# EasyEDA schematic SCH_OPN+OPLL Mixer v0.1_2023-10-10.json

## Sheets
1 Connector: TITLE: Sheet_1; REV: 1.0; Date: 2023-10-09; Sheet: 1/1; Drawn By: Denjhang; Company: Your Company
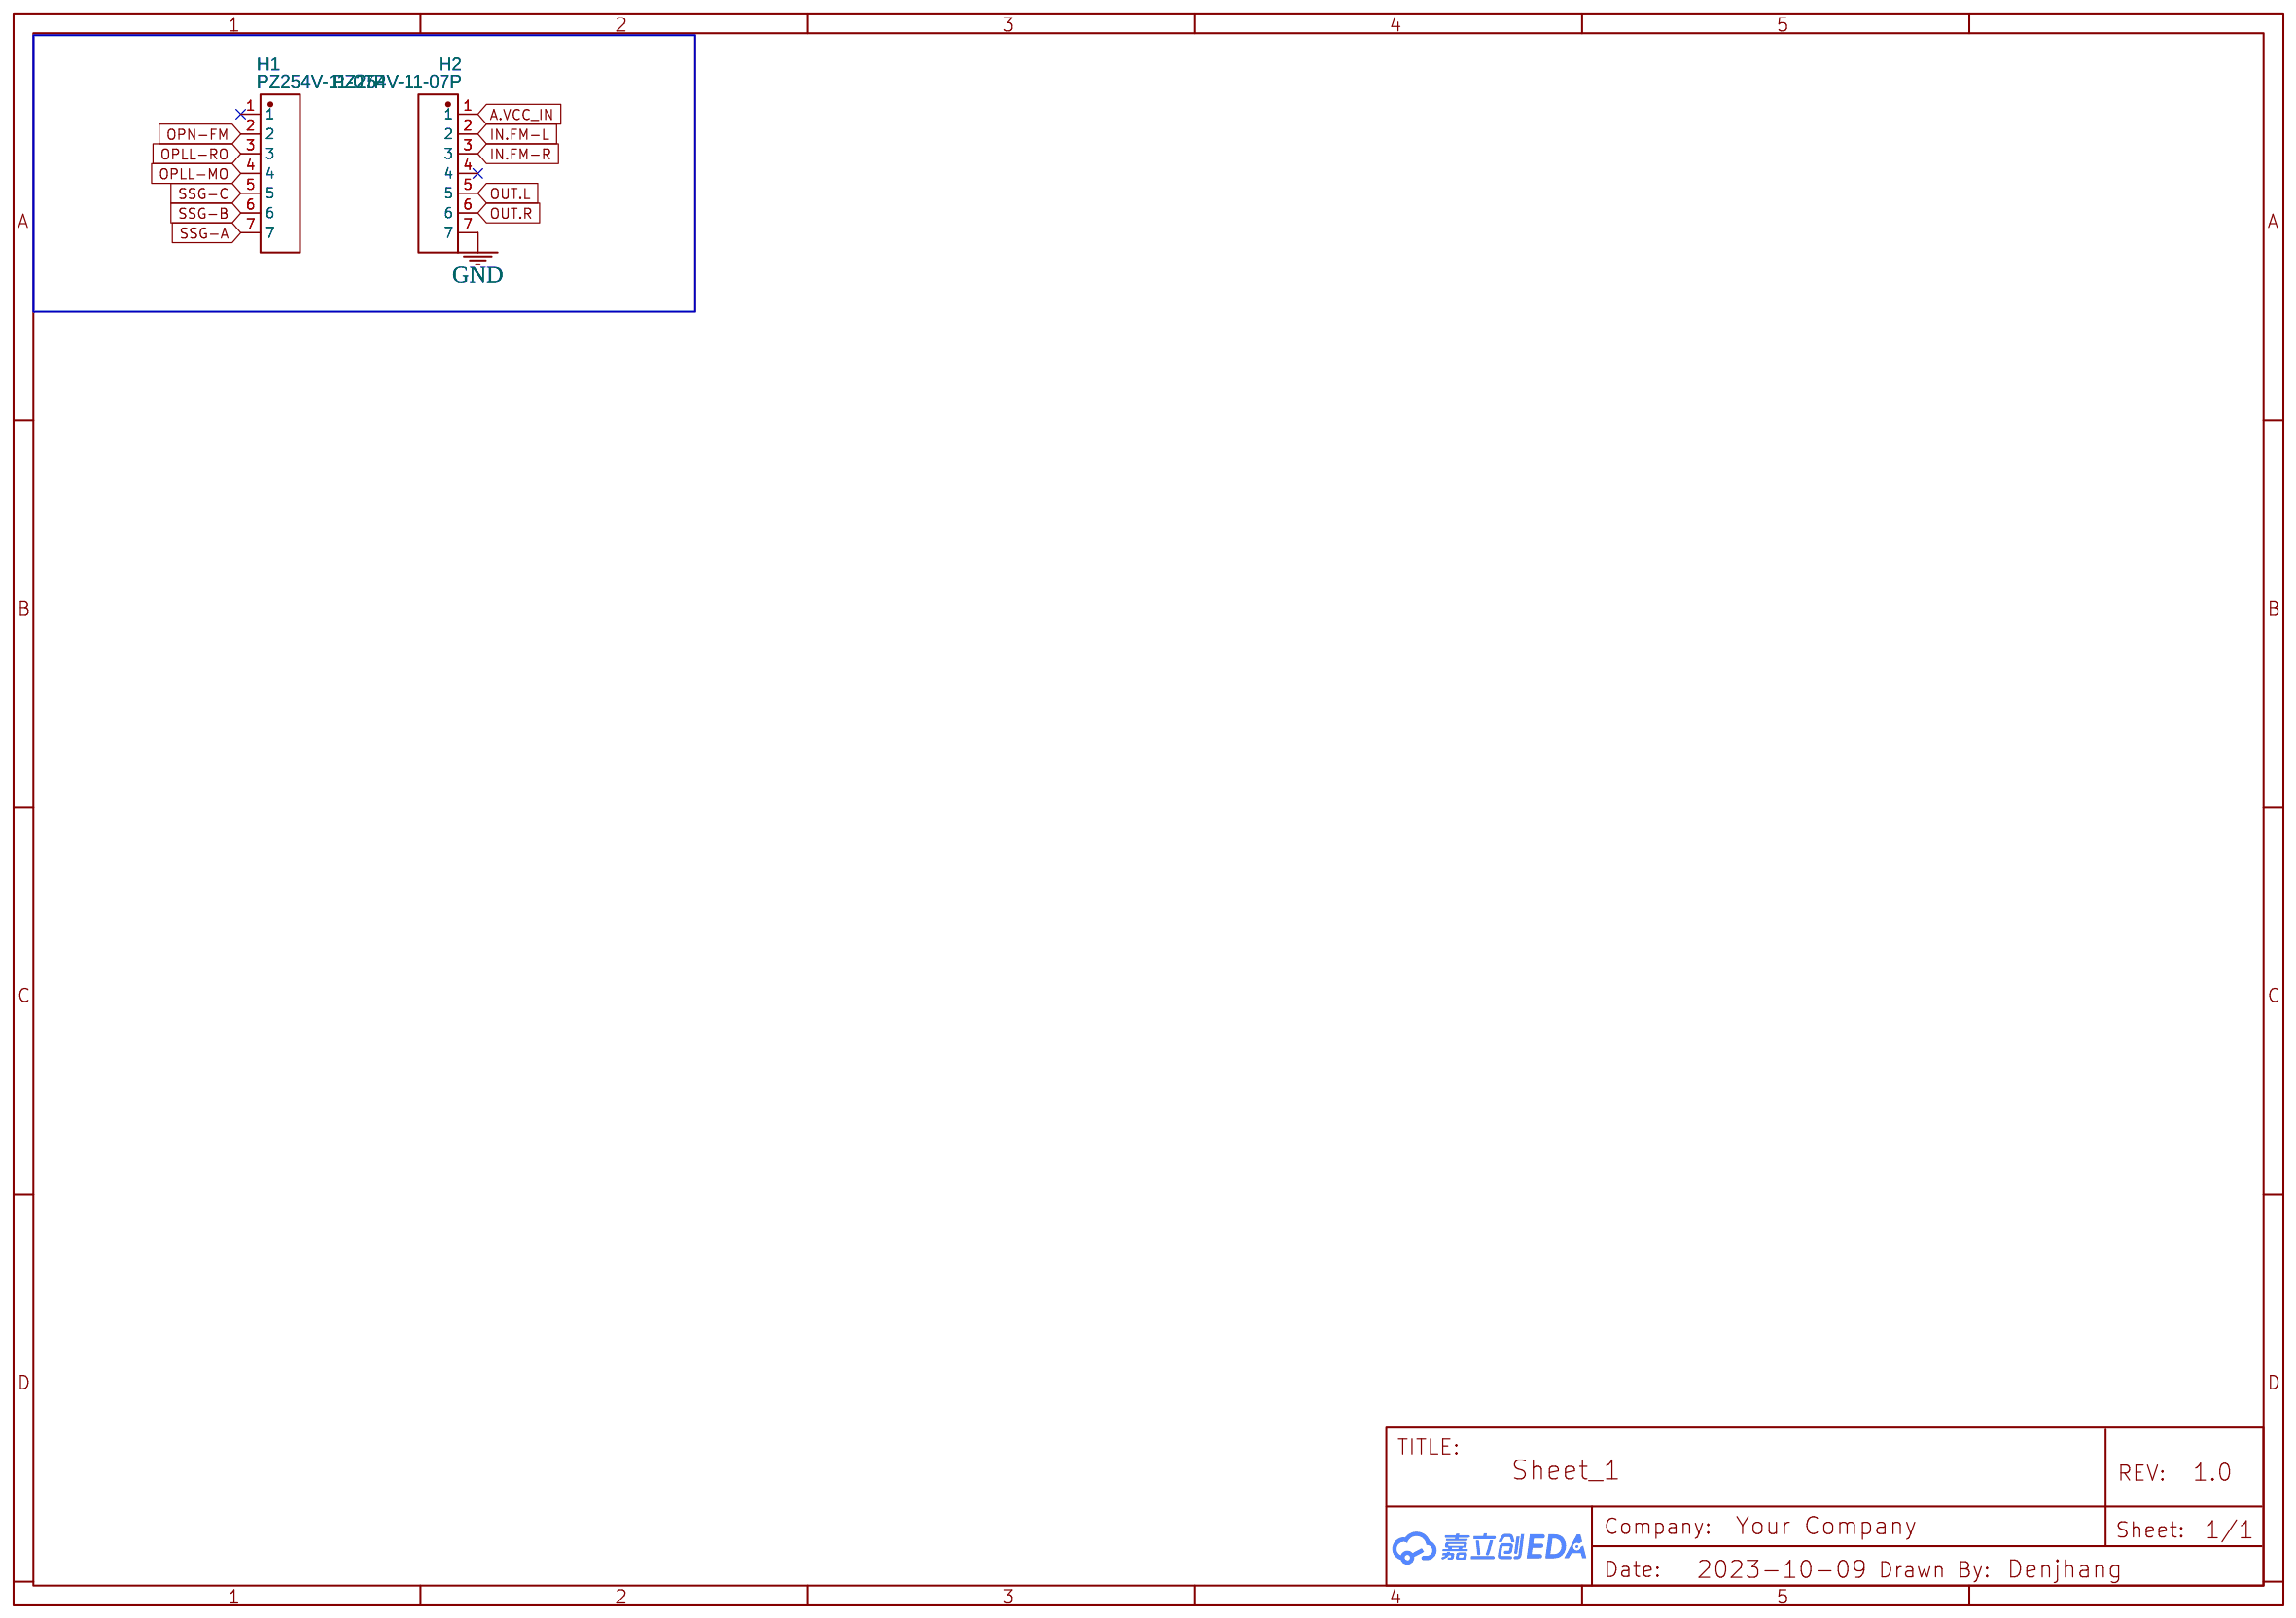
[diagram p0: Connector]
2 OPLL-AMP
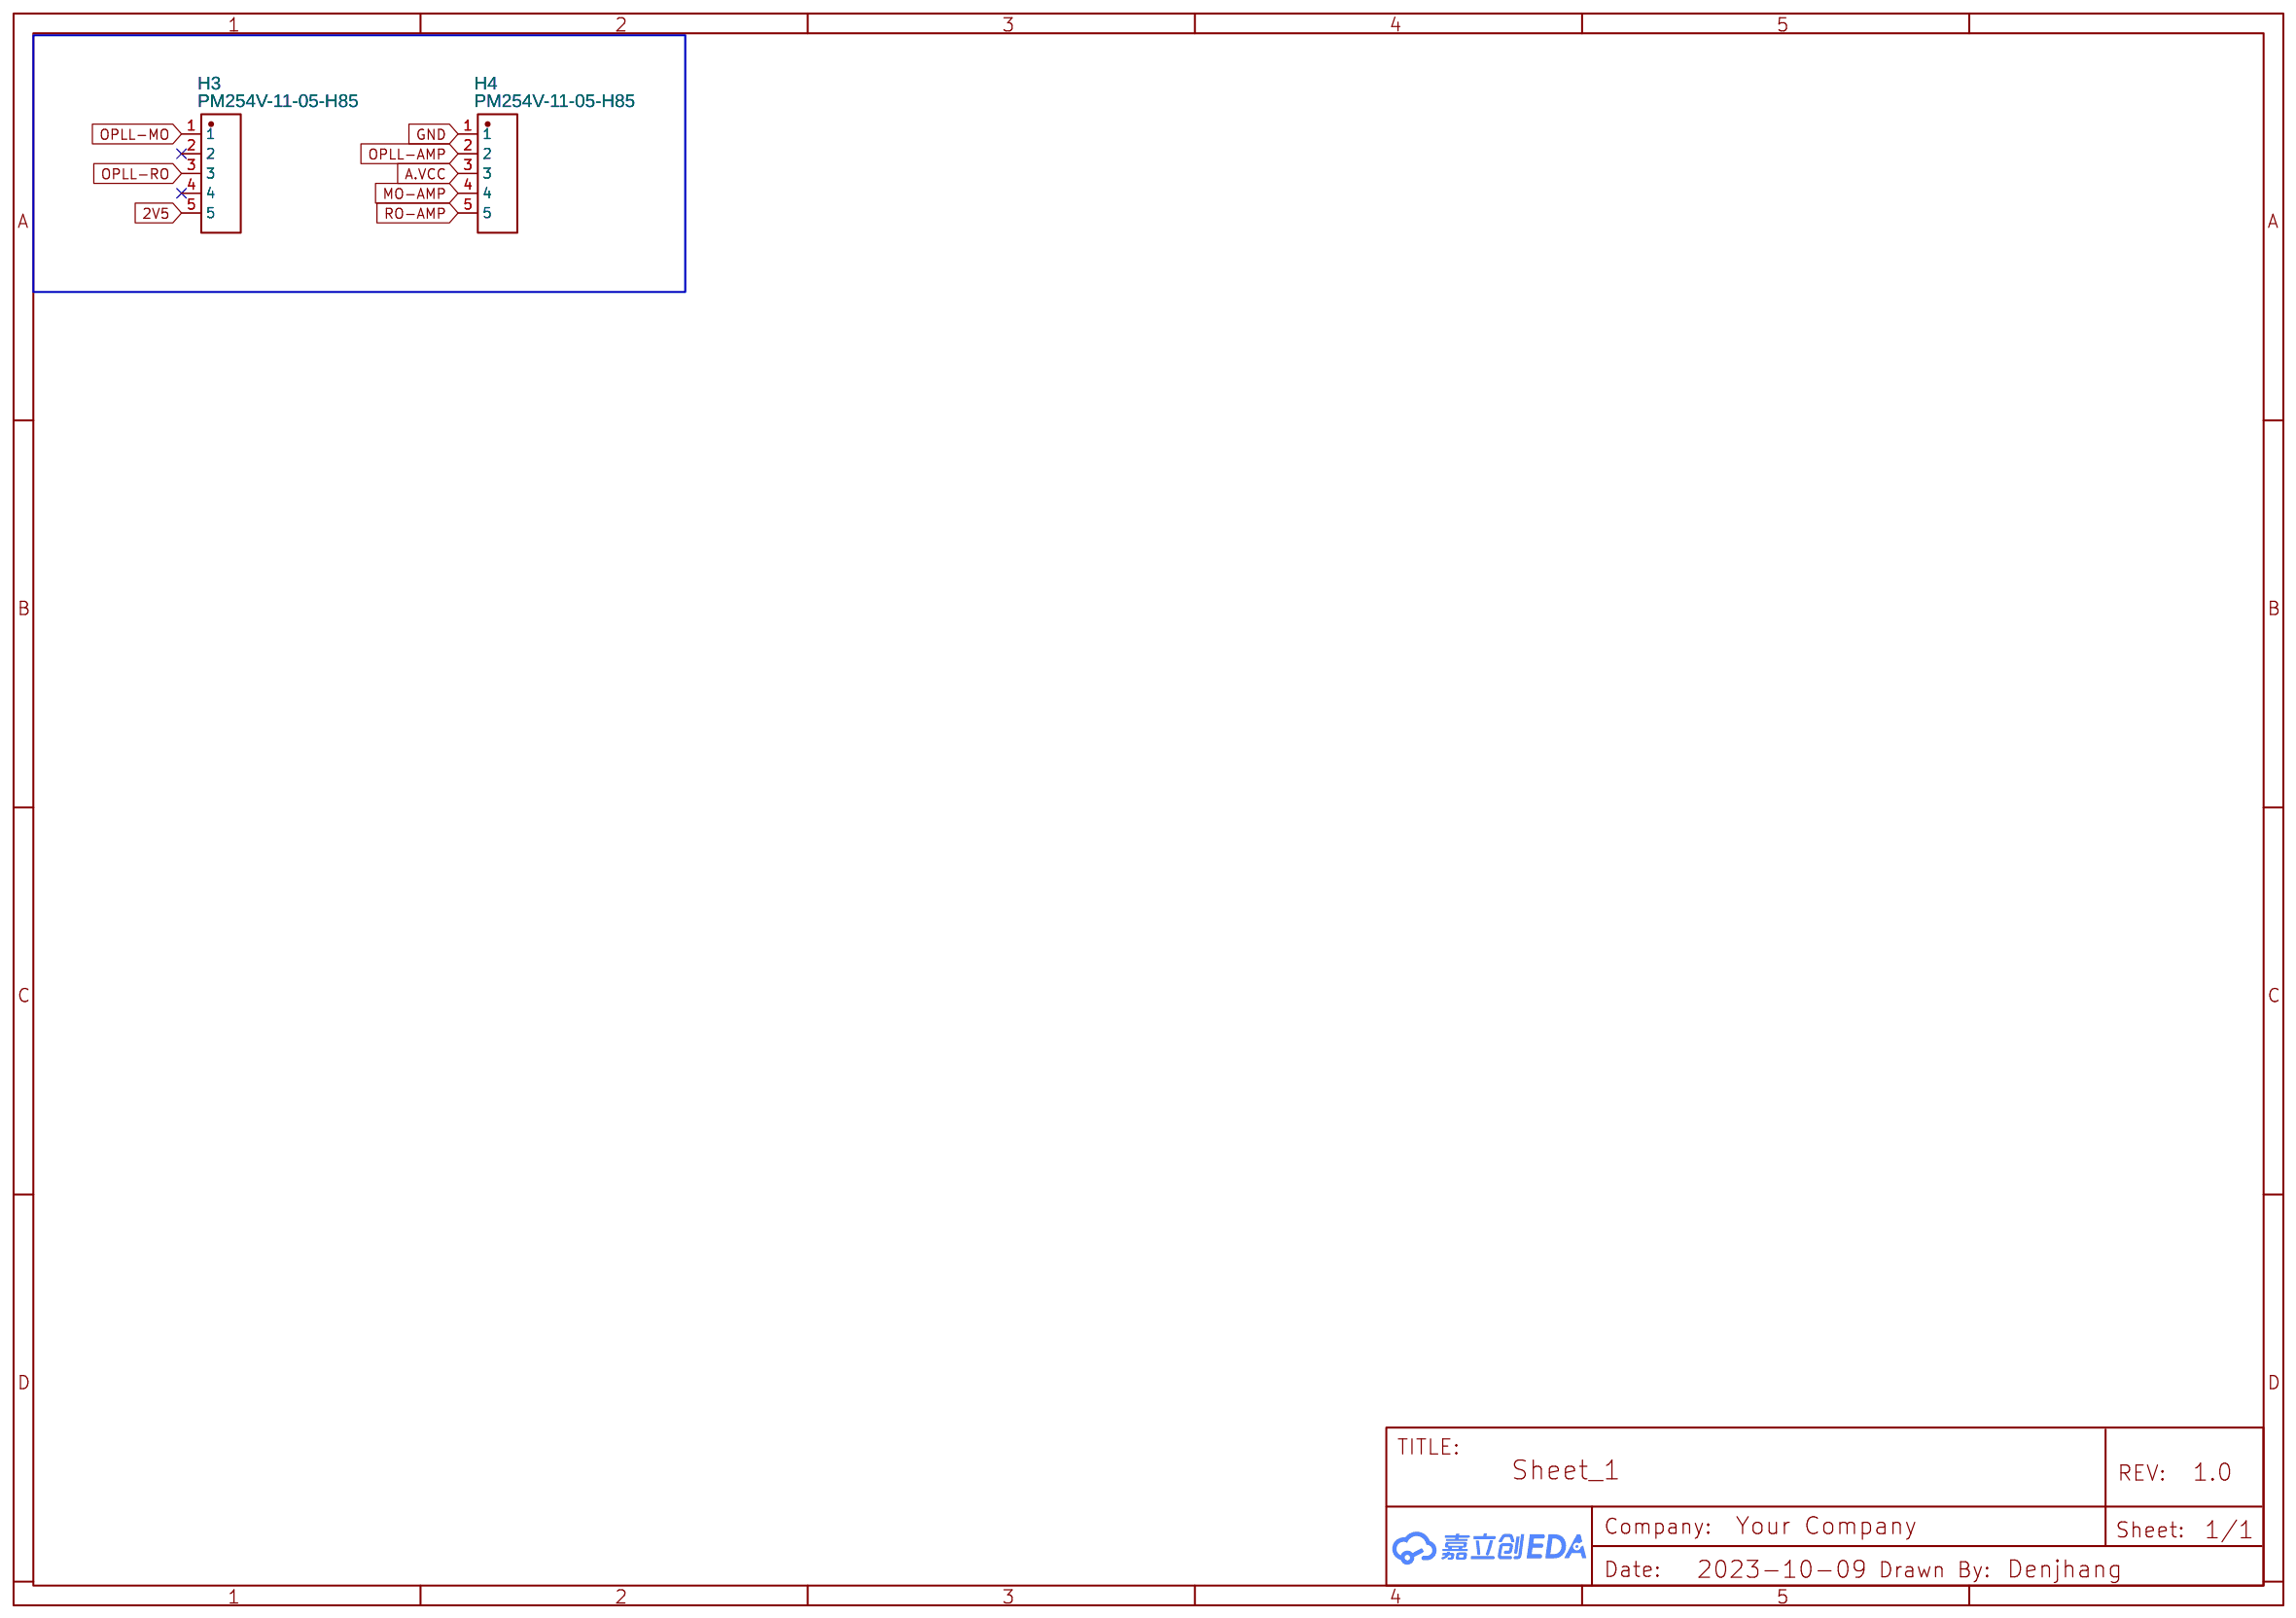
[diagram p1: OPLL-AMP]
3 SSG-Stereo
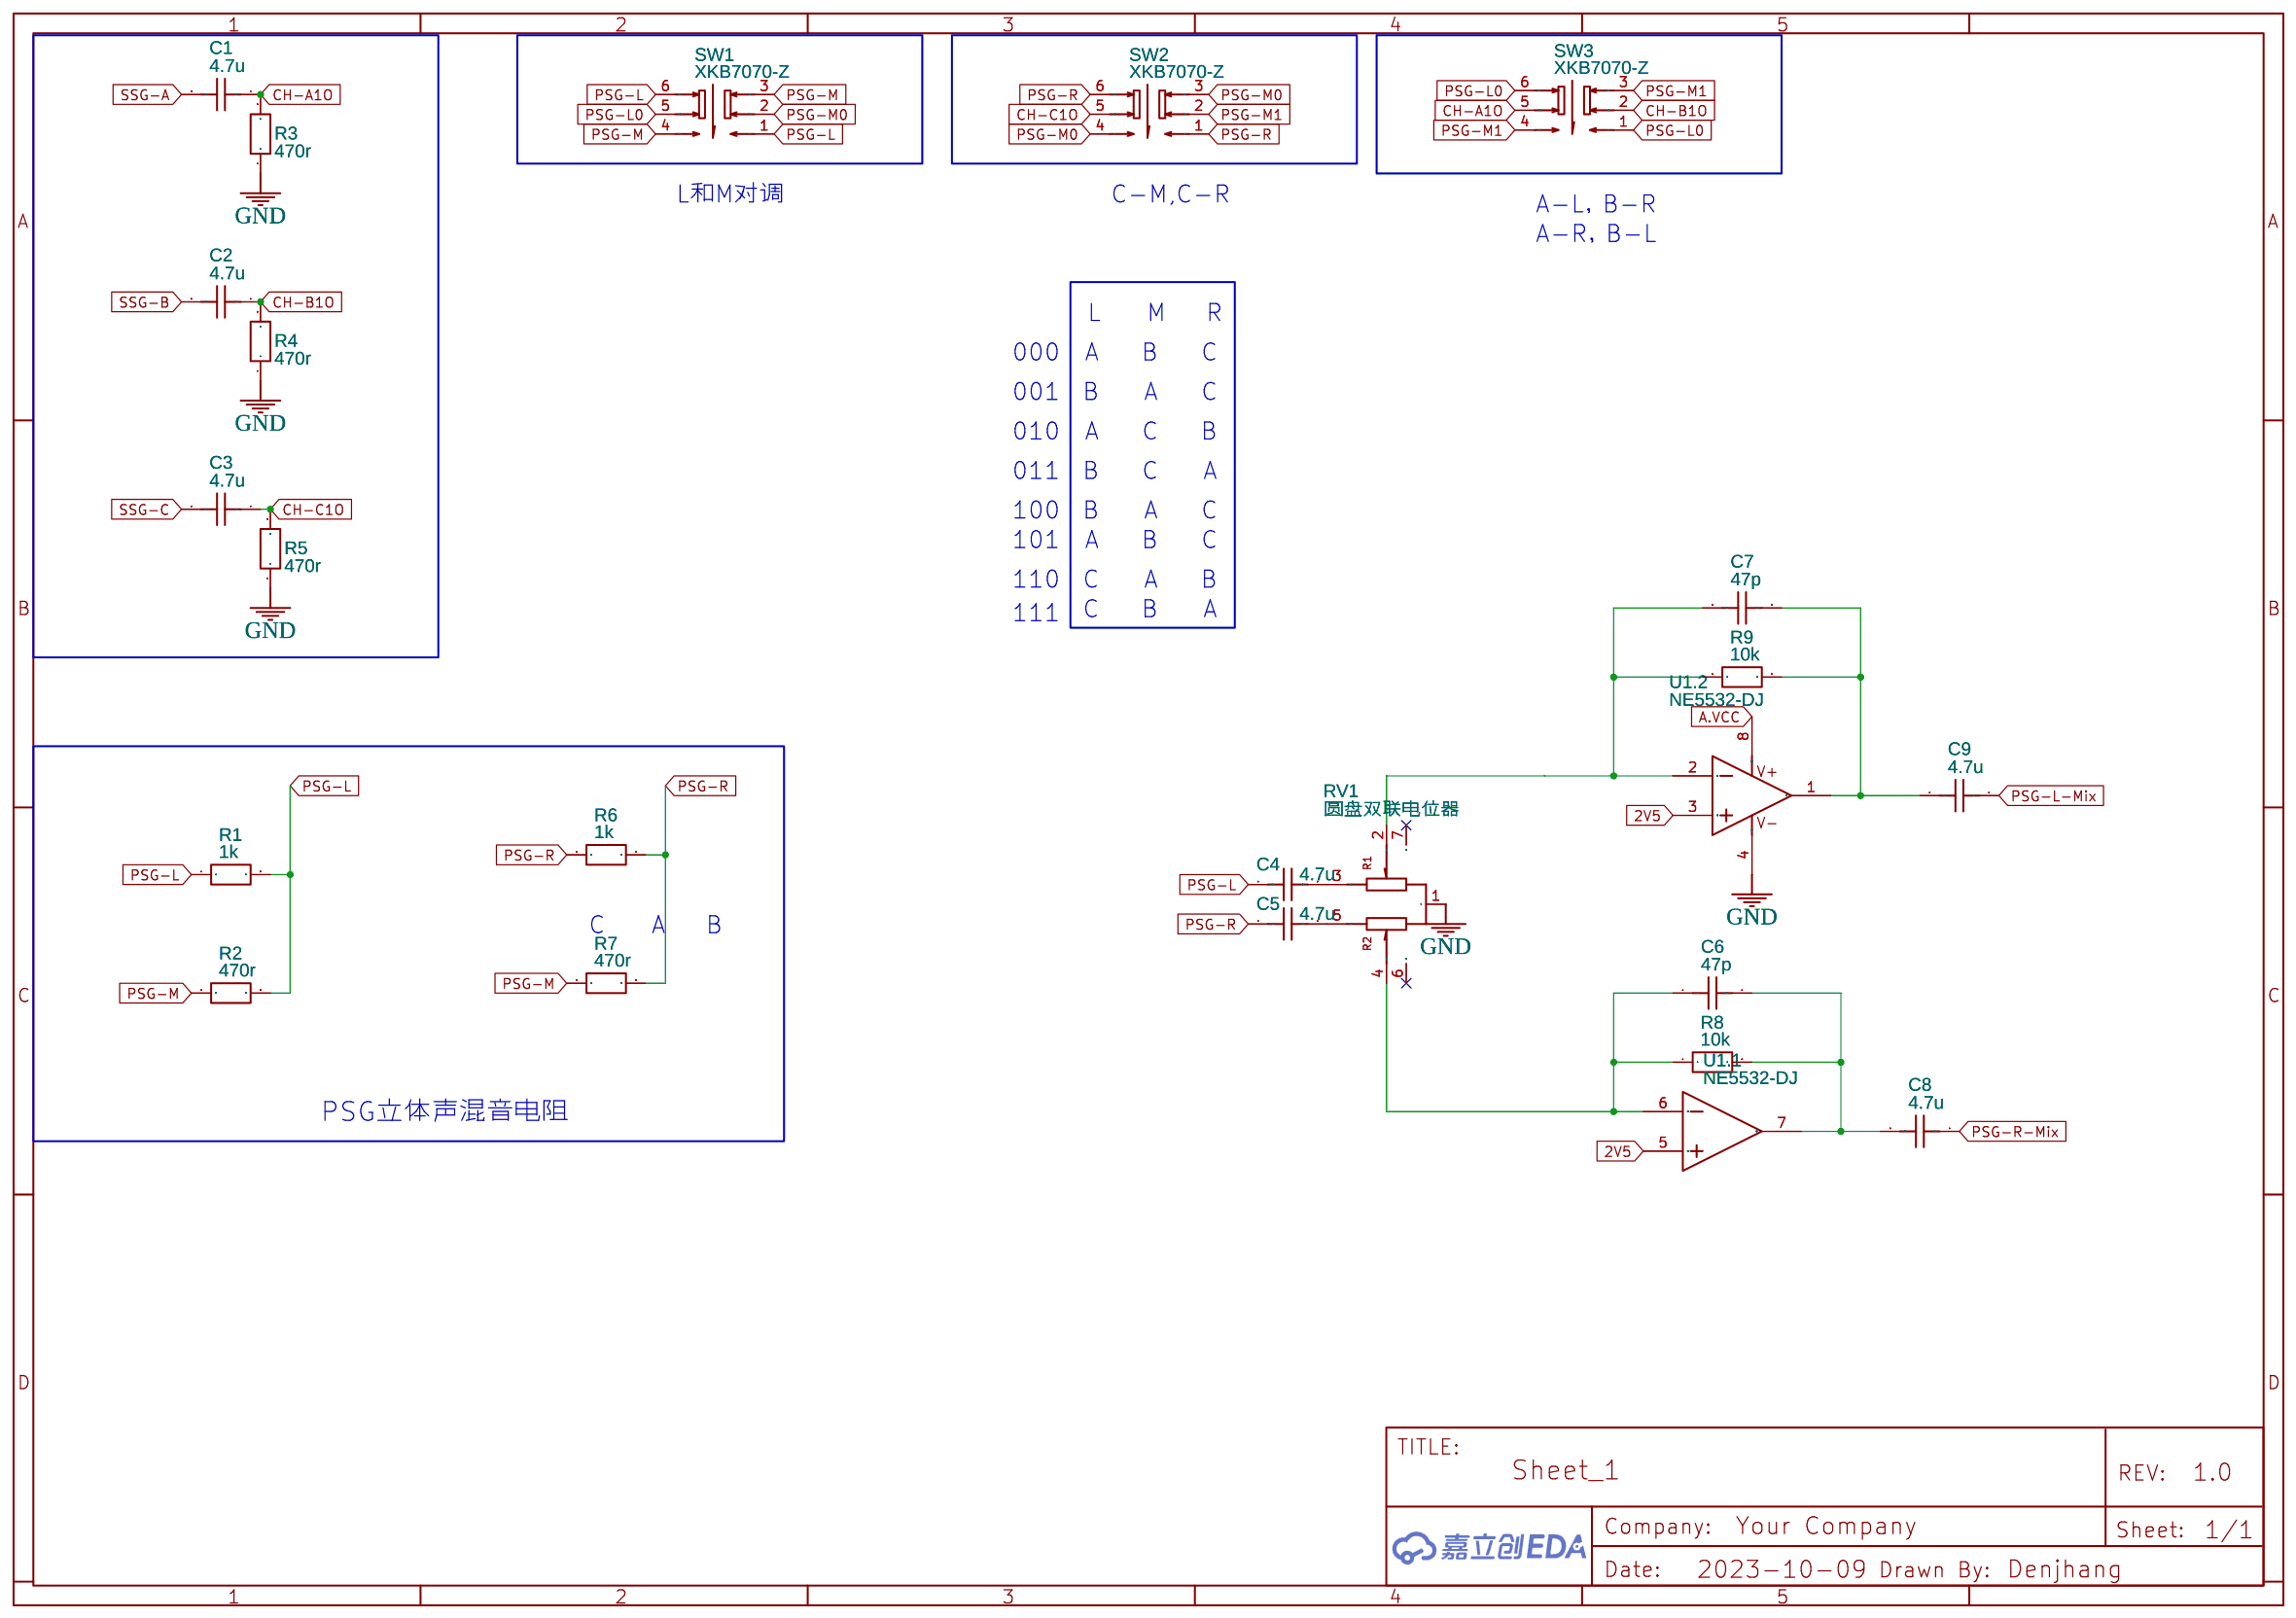
[diagram p2: SSG-Stereo]
4 FM-Stereo
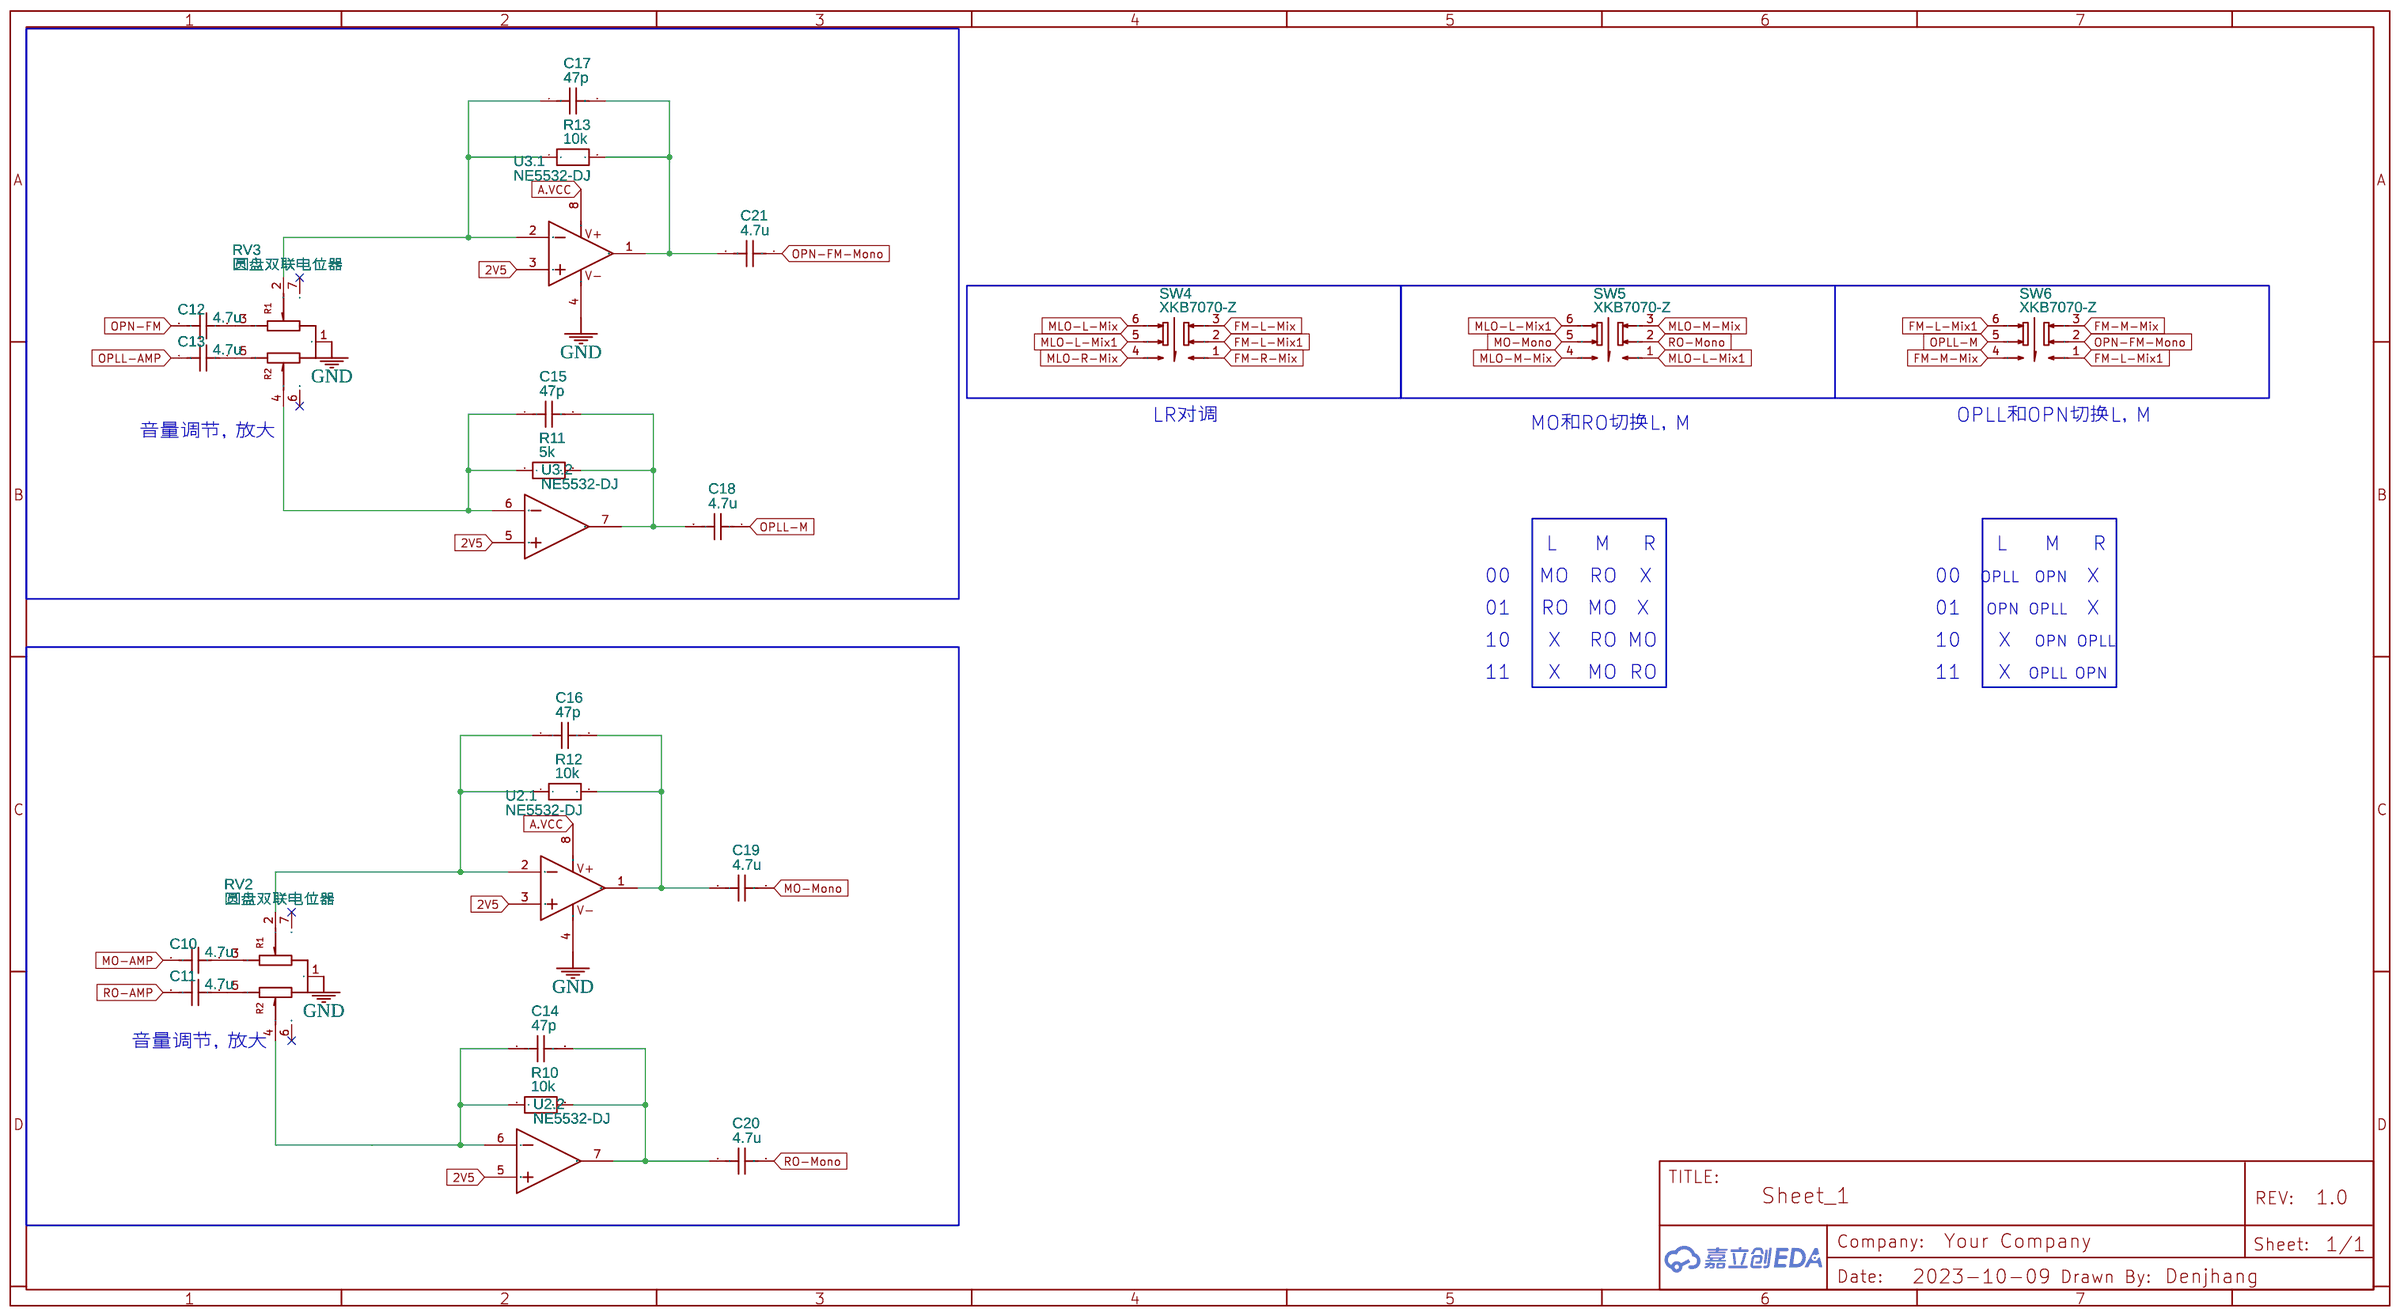
[diagram p3: FM-Stereo]
5 Mixer: TITLE: Sheet_2
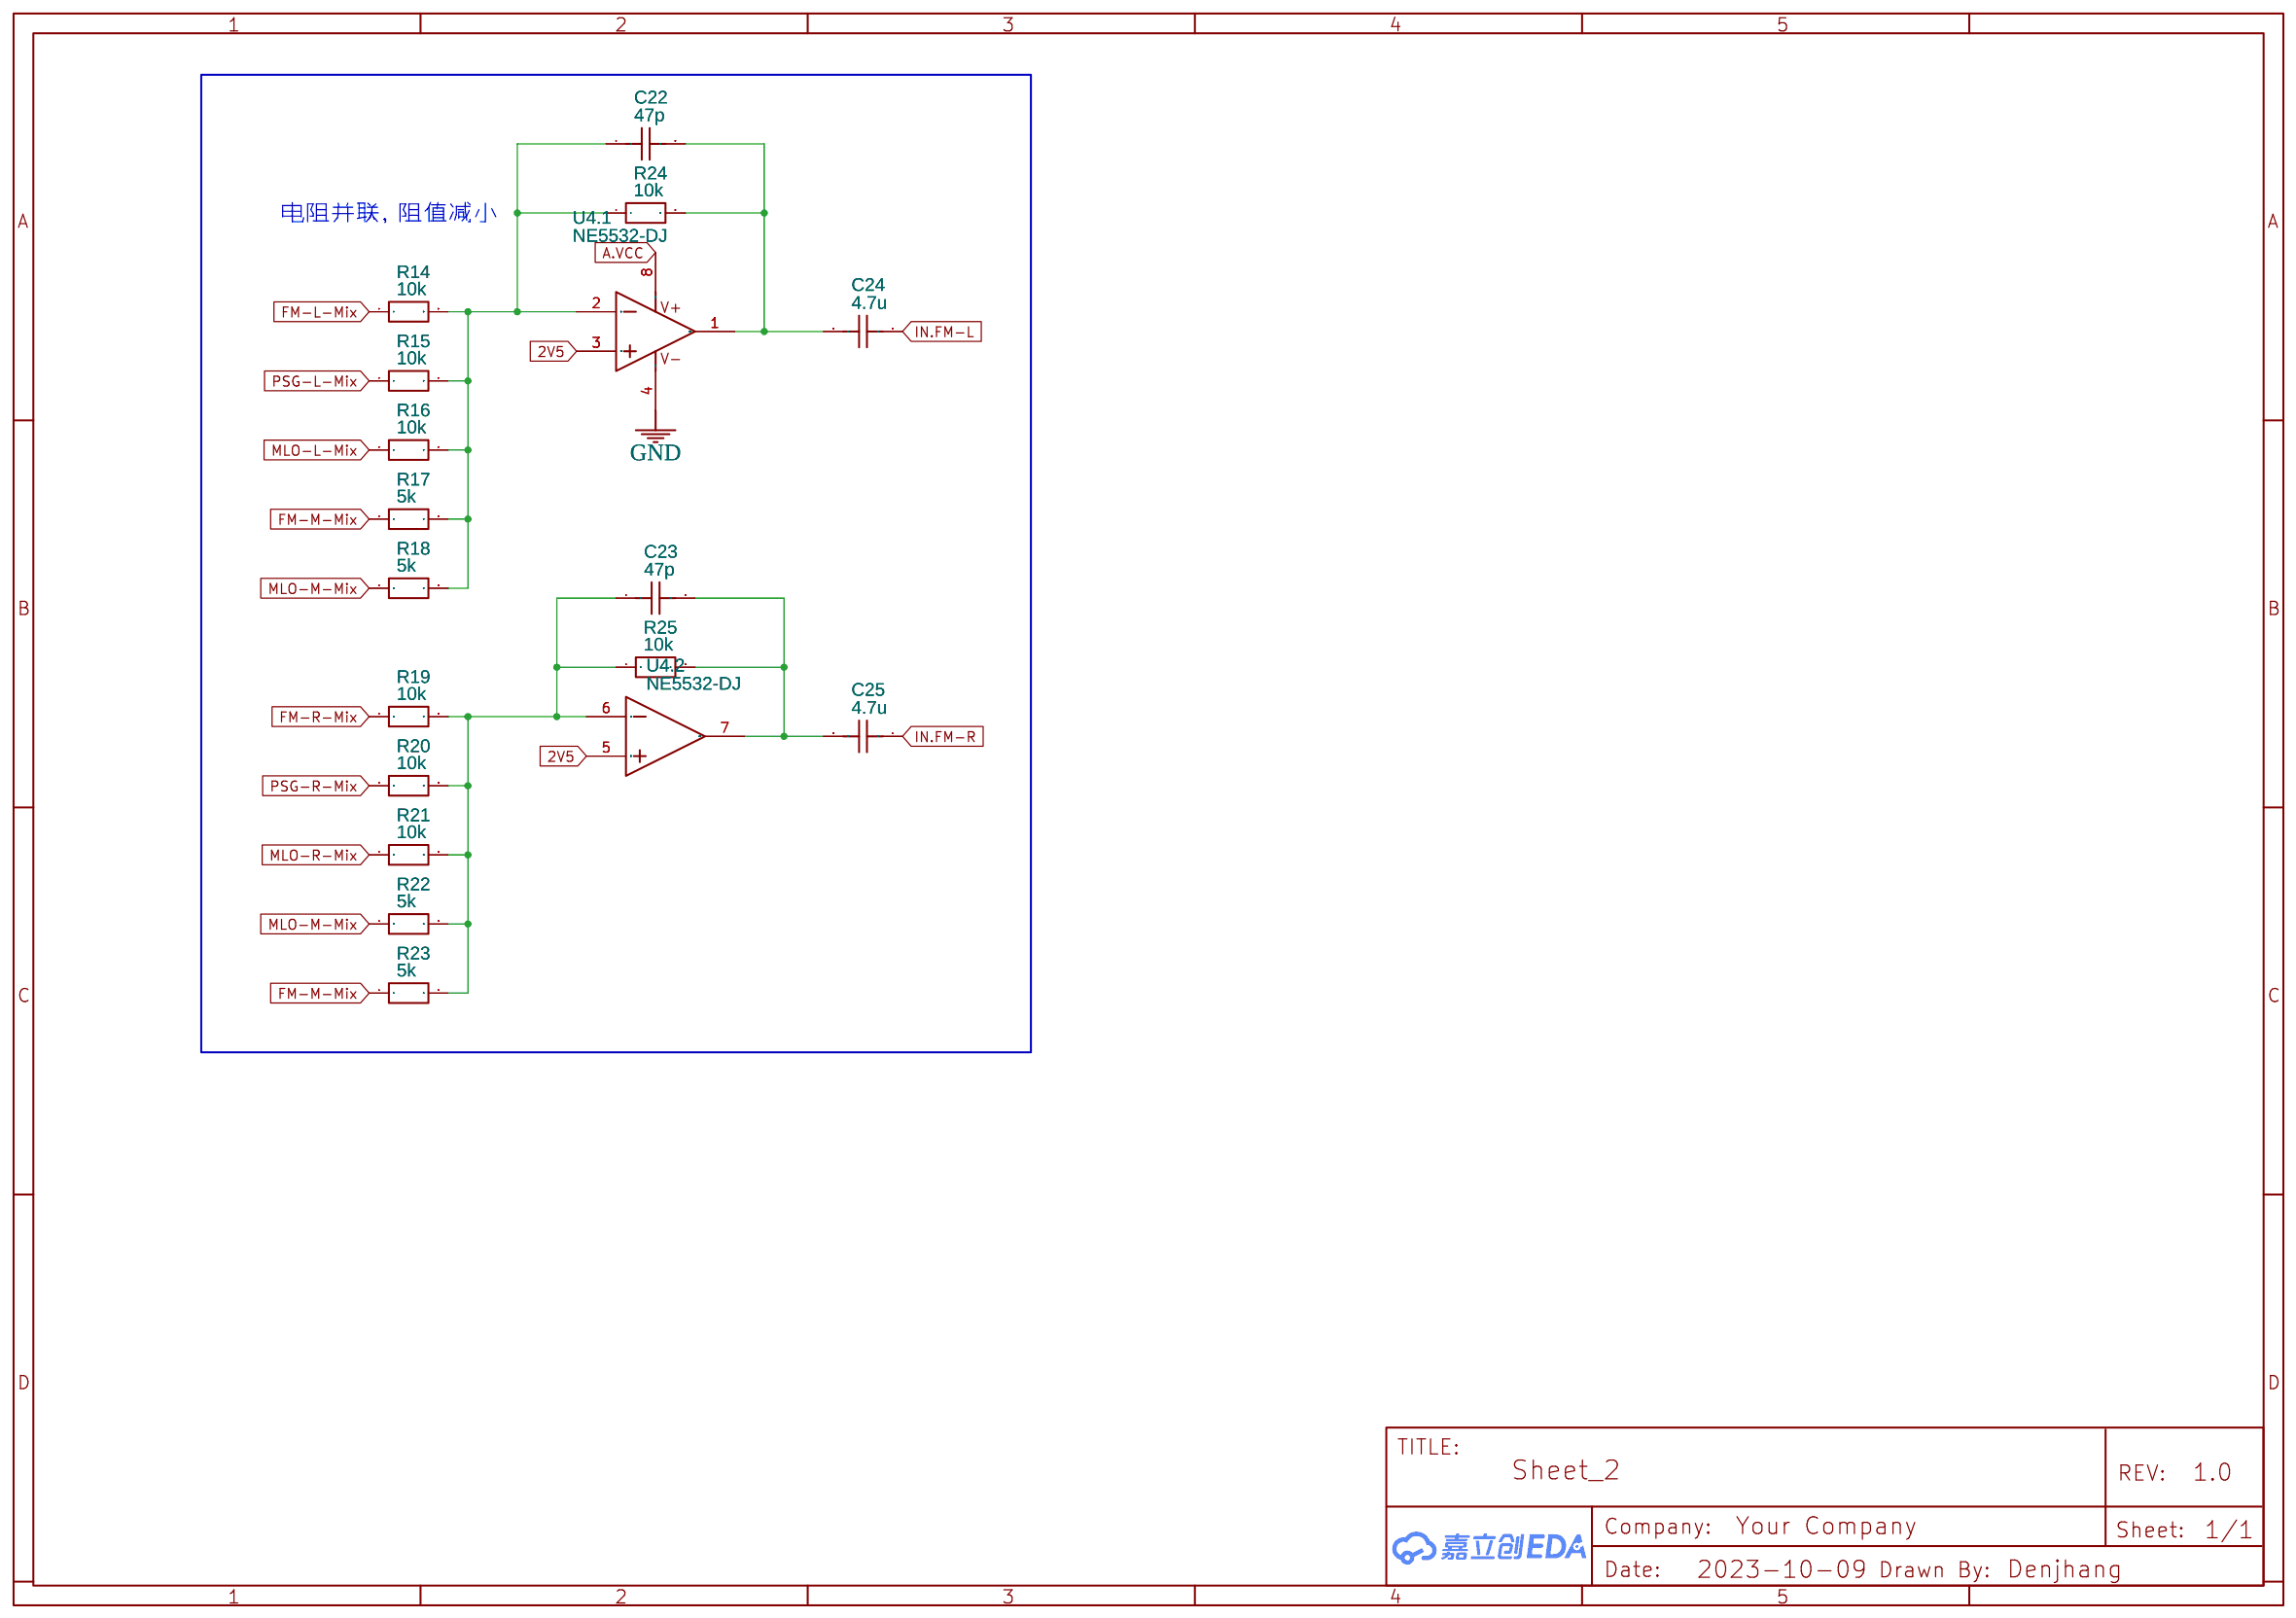
[diagram p4: Mixer]
6 PSU
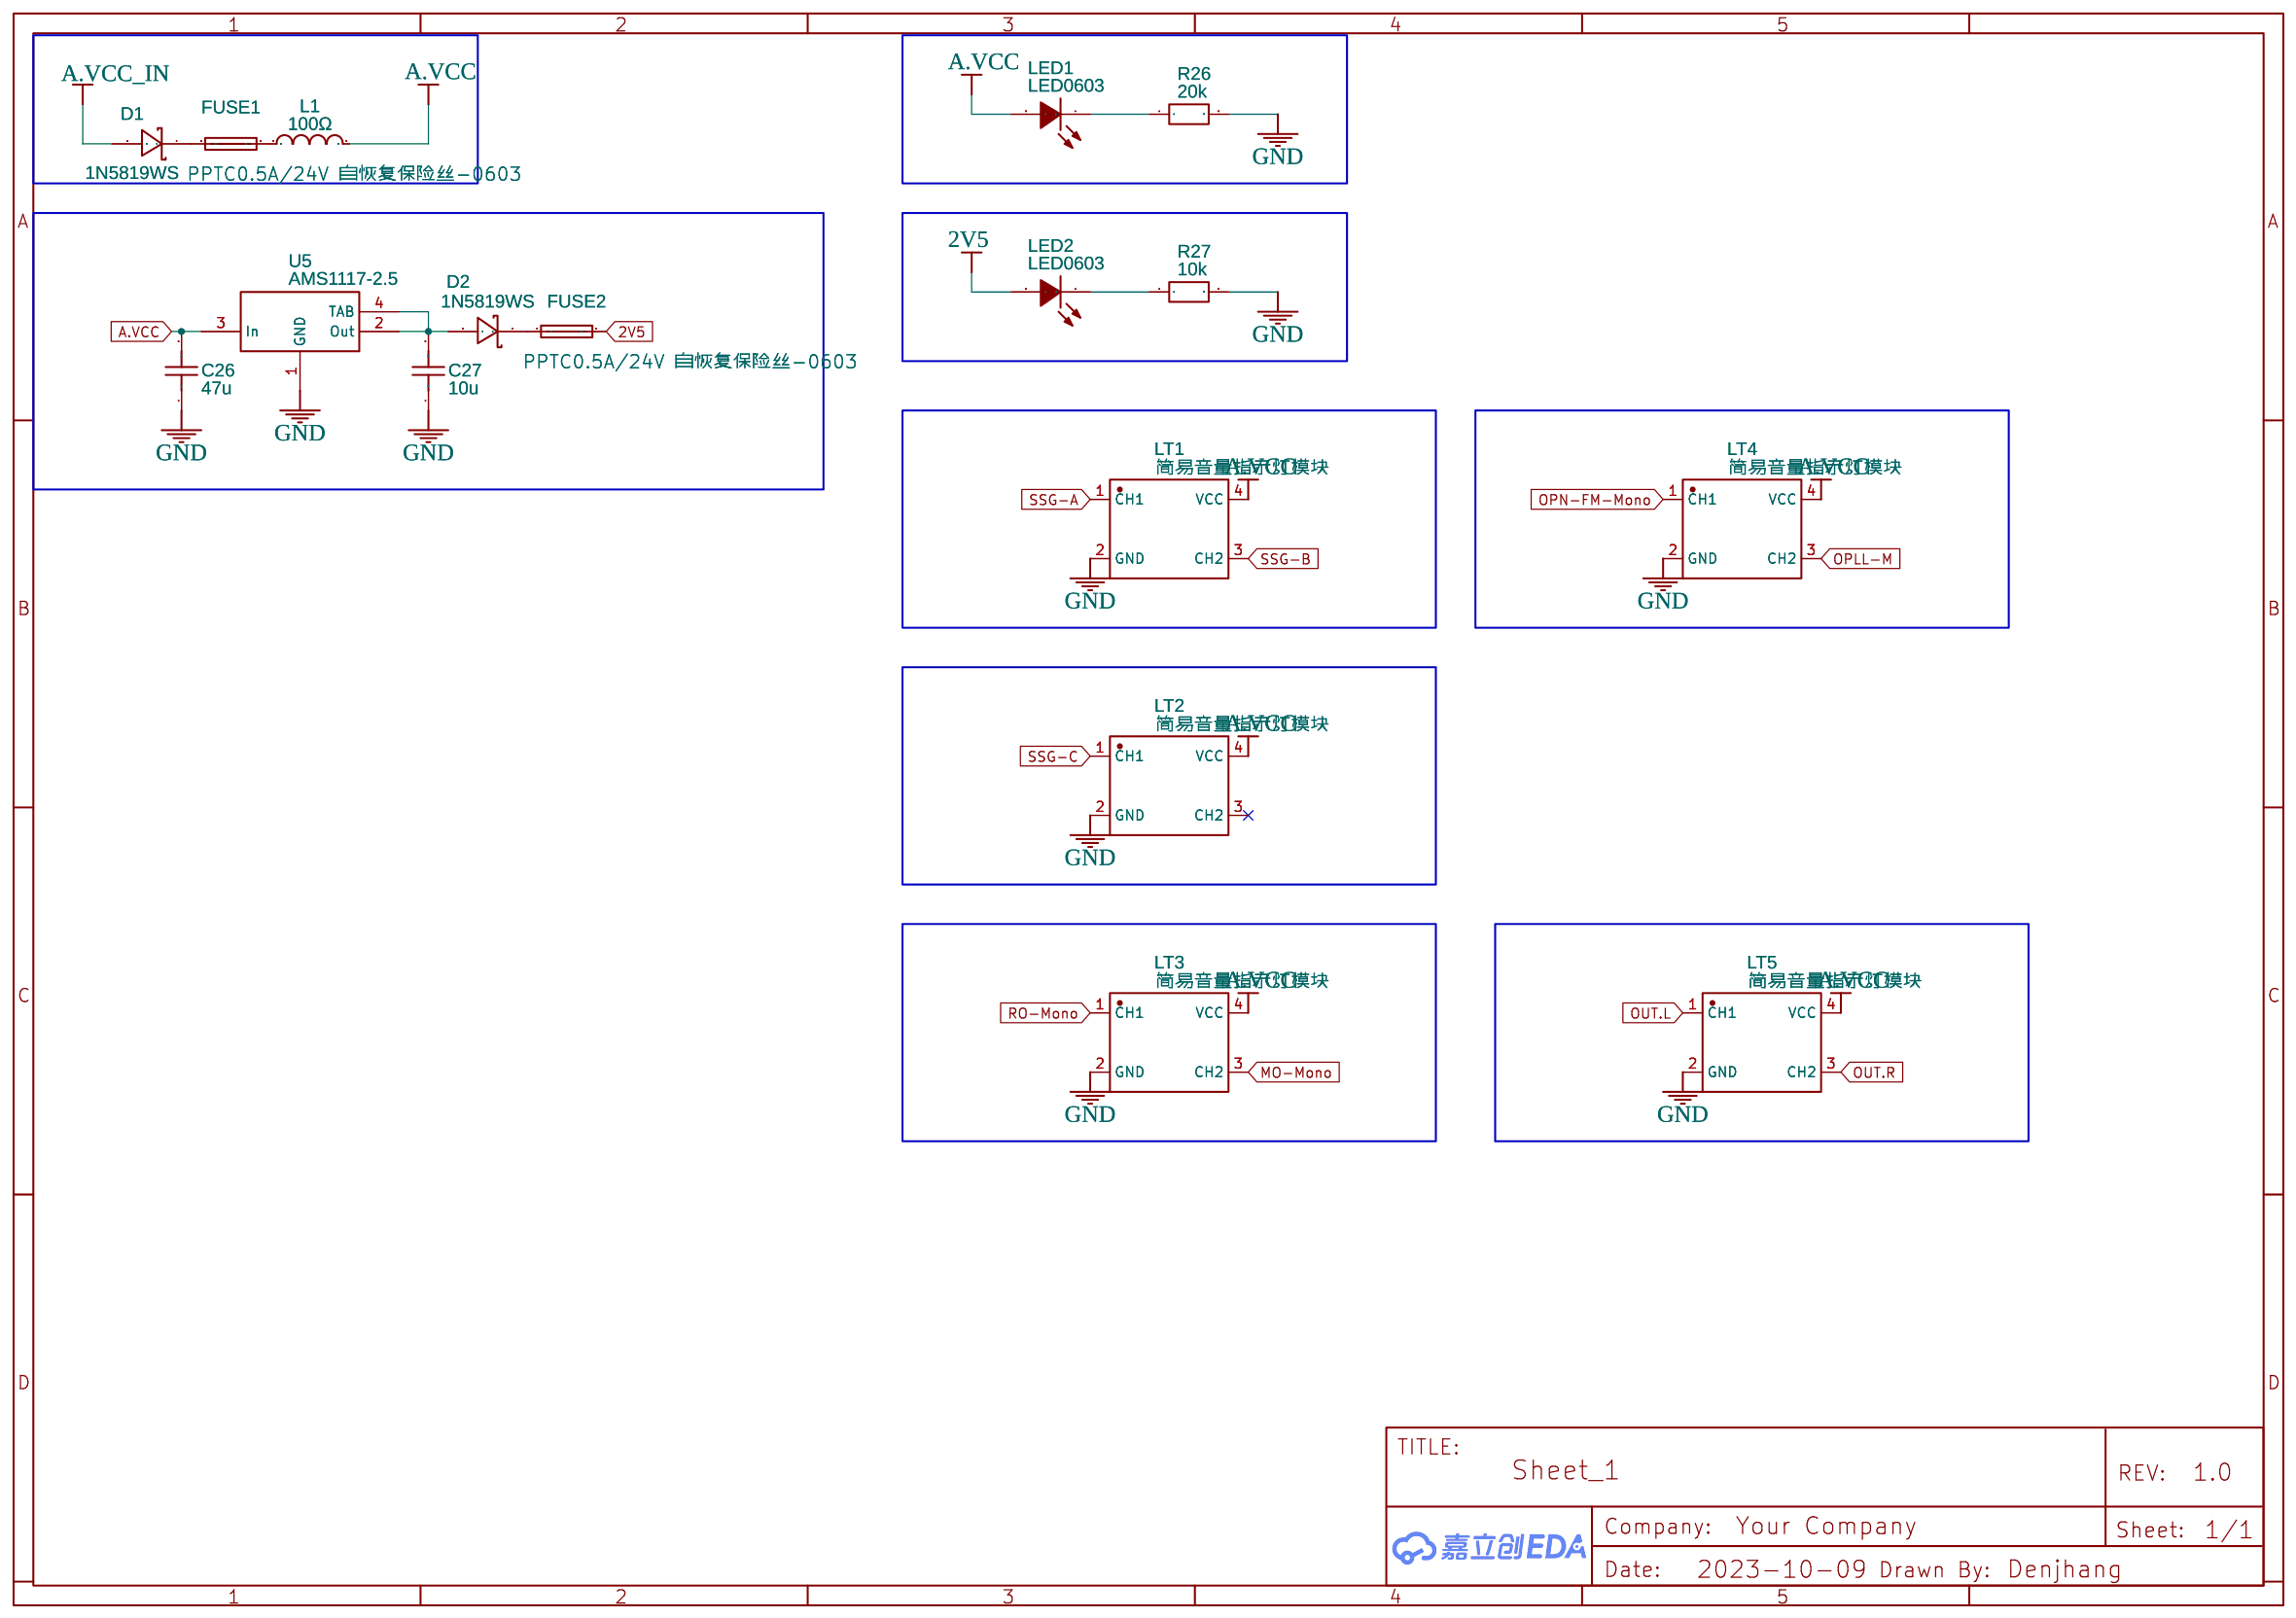
[diagram p5: PSU]
7 OUT
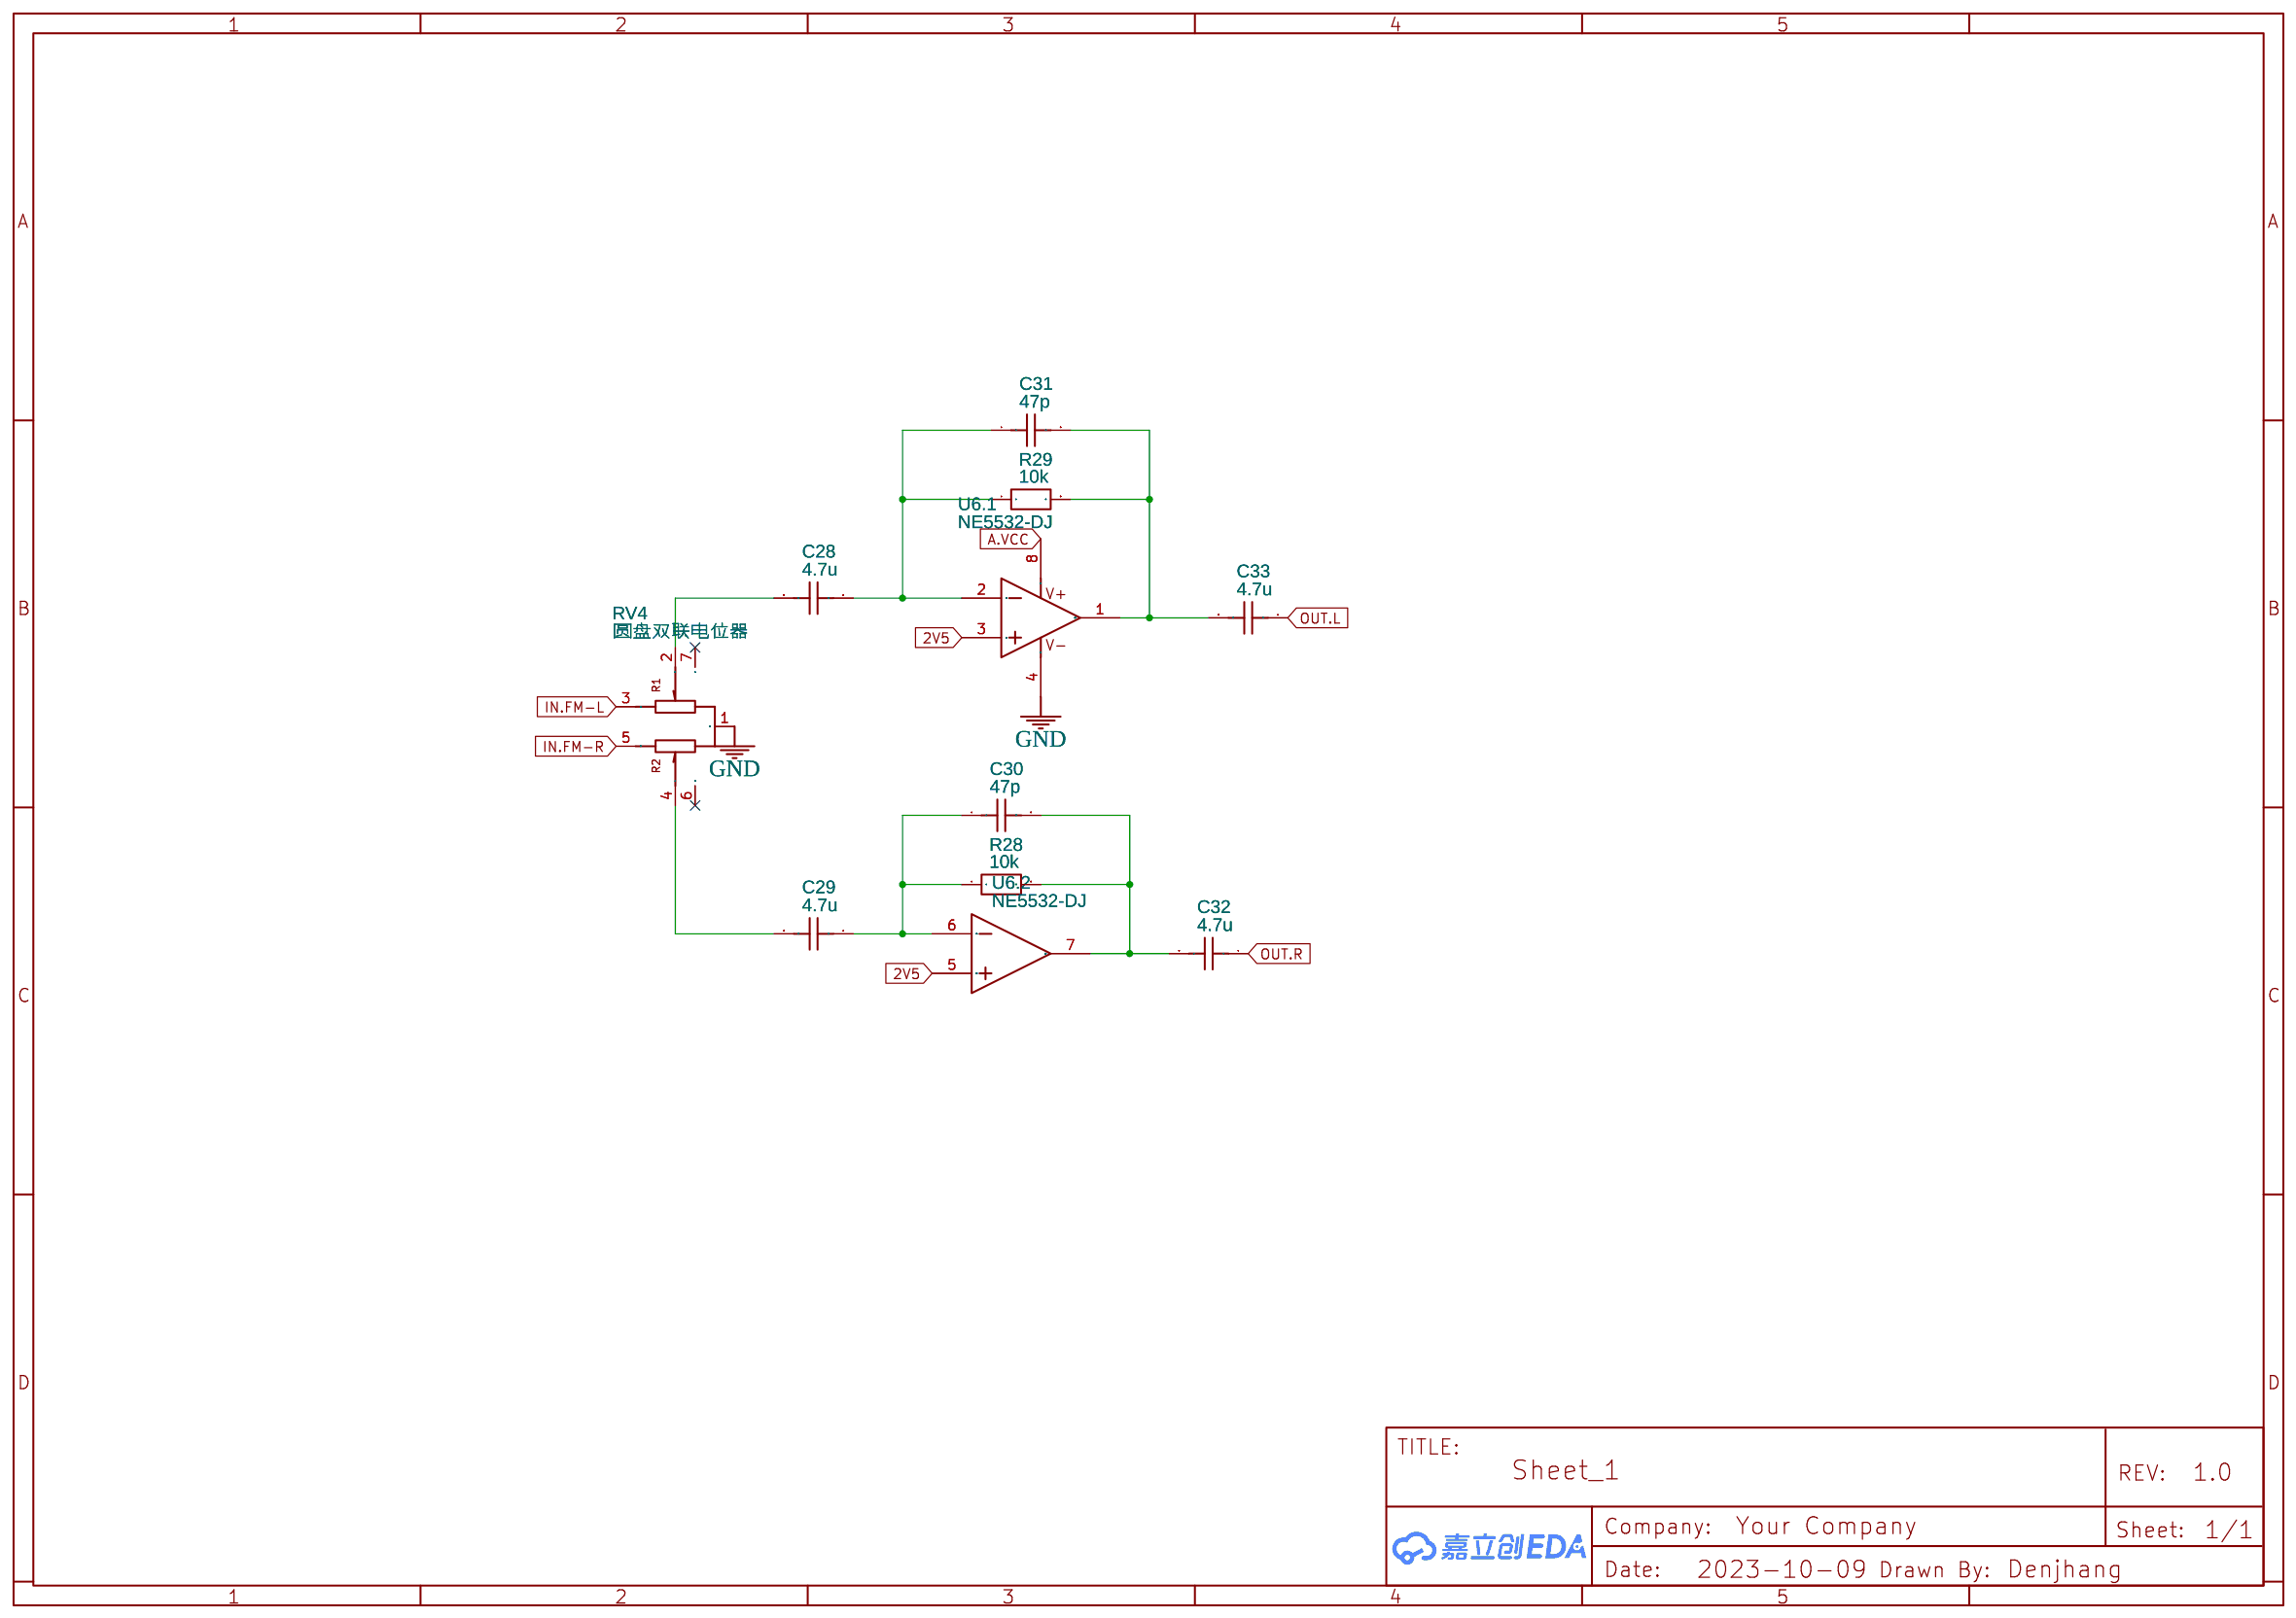
[diagram p6: OUT]

## Parts
sheet Connector
H1  PZ254V-11-07P  [HDR-TH_7P-P2.54-V-M]
H2  PZ254V-11-07P  [HDR-TH_7P-P2.54-V-M]
sheet FM-Stereo
C10  4.7u  [C0805]
C11  4.7u  [C0805]
C12  4.7u  [C0805]
C13  4.7u  [C0805]
C14  47p  [C0603]
C15  47p  [C0603]
C16  47p  [C0603]
C17  47p  [C0603]
C18  4.7u  [C0805]
C19  4.7u  [C0805]
C20  4.7u  [C0805]
C21  4.7u  [C0805]
R10  10k  [R0603]
R11  5k  [R0603]
R12  10k  [R0603]
R13  10k  [R0603]
RV2  圆盘双联电位器  [RES-TH_RK10J12E002L]
RV3  圆盘双联电位器  [RES-TH_RK10J12E002L]
SW4  XKB7070-Z  [SW-TH_6P-L7.0-W7.0-P2.00]
SW5  XKB7070-Z  [SW-TH_6P-L7.0-W7.0-P2.00]
SW6  XKB7070-Z  [SW-TH_6P-L7.0-W7.0-P2.00]
U2  NE5532-DJ  [DIP-8-DJ]  (sections 1,2)
U3  NE5532-DJ  [DIP-8-DJ]  (sections 1,2)
sheet Mixer
C22  47p  [C0603]
C23  47p  [C0603]
C24  4.7u  [C0805]
C25  4.7u  [C0805]
R14  10k  [R0603]
R15  10k  [R0603]
R16  10k  [R0603]
R17  5k  [R0603]
R18  5k  [R0603]
R19  10k  [R0603]
R20  10k  [R0603]
R21  10k  [R0603]
R22  5k  [R0603]
R23  5k  [R0603]
R24  10k  [R0603]
R25  10k  [R0603]
U4  NE5532-DJ  [DIP-8-DJ]  (sections 1,2)
sheet OPLL-AMP
H3  PM254V-11-05-H85  [HDR-TH_5P-P2.54-V-F]
H4  PM254V-11-05-H85  [HDR-TH_5P-P2.54-V-F]
sheet OUT
C28  4.7u  [C0805]
C29  4.7u  [C0805]
C30  47p  [C0603]
C31  47p  [C0603]
C32  4.7u  [C0805]
C33  4.7u  [C0805]
R28  10k  [R0603]
R29  10k  [R0603]
RV4  圆盘双联电位器  [RES-TH_RK10J12E002L]
U6  NE5532-DJ  [DIP-8-DJ]  (sections 1,2)
sheet PSU
C26  47u  [C0805]
C27  10u  [C0805]
D1  1N5819WS  [SOD-323_L1.8-W1.3-LS2.5-RD]
D2  1N5819WS  [SOD-323_L1.8-W1.3-LS2.5-RD]
FUSE1  PPTC0.5A/24V 自恢复保险丝-0603  [F0603]
FUSE2  PPTC0.5A/24V 自恢复保险丝-0603  [F0603]
L1  100Ω  [L0603]
LED1  LED0603  [LED0603-RD]
LED2  LED0603  [LED0603-RD]
LT1  简易音量指示灯模块  [简易音量指示灯模块]
LT2  简易音量指示灯模块  [简易音量指示灯模块]
LT3  简易音量指示灯模块  [简易音量指示灯模块]
LT4  简易音量指示灯模块  [简易音量指示灯模块]
LT5  简易音量指示灯模块  [简易音量指示灯模块]
R26  20k  [R0603]
R27  10k  [R0603]
U5  AMS1117-2.5  [SOT-223-4_L6.5-W3.5-P2.30-LS7.0-BR]
sheet SSG-Stereo
C1  4.7u  [C0805]
C2  4.7u  [C0805]
C3  4.7u  [C0805]
C4  4.7u  [C0805]
C5  4.7u  [C0805]
C6  47p  [C0603]
C7  47p  [C0603]
C8  4.7u  [C0805]
C9  4.7u  [C0805]
R1  1k  [R0603]
R2  470r  [R0603]
R3  470r  [R0603]
R4  470r  [R0603]
R5  470r  [R0603]
R6  1k  [R0603]
R7  470r  [R0603]
R8  10k  [R0603]
R9  10k  [R0603]
RV1  圆盘双联电位器  [RES-TH_RK10J12E002L]
SW1  XKB7070-Z  [SW-TH_6P-L7.0-W7.0-P2.00]
SW2  XKB7070-Z  [SW-TH_6P-L7.0-W7.0-P2.00]
SW3  XKB7070-Z  [SW-TH_6P-L7.0-W7.0-P2.00]
U1  NE5532-DJ  [DIP-8-DJ]  (sections 1,2)

## Library data of the parts
H1 H2 = PZ254V-11-07P: Contributor: LCSC; Supplier: LCSC; Supplier Part: C492406; Manufacturer: XFCN(兴飞); JLCPCB Part Class: Extended Part; link: https://so.szlcsc.com/global.html?k=C492406&ref=editor
C1-C5 C8-C13 C18-C21 C24-C29 C32 C33 = C_0805_US: Contributor: LCEDA_Lib
C6 C7 C14-C17 C22 C23 C30 C31 = C_0603_US: Contributor: LCEDA_Lib
R1-R29 = R_0603_EU: Contributor: LCEDA_Lib
RV1-RV4 = 圆盘双联电位器: Contributor: Denjhang
SW1-SW6 = XKB7070-Z: Contributor: LCSC; Supplier: LCSC; Supplier Part: C318863; Manufacturer: XKB Connectivity(中国星坤); JLCPCB Part Class: Extended Part; link: https://so.szlcsc.com/global.html?k=C318863&ref=editor
U1-U4 U6 = NE5532-DJ: tags: Audio Operational Amplifier; Supplier Part: C5326; Supplier: LCSC; Manufacturer: TI; Manufacturer Part: NE5532P; subpart_no: 1; image: http://image.lceda.cn/szlcsc/C5326.jpg; JLCPCB Part Class: Extended Part; Contributor: Denjhang
H3 H4 = PM254V-11-05-H85: Contributor: LCSC; Supplier: LCSC; Supplier Part: C541852; Manufacturer: XFCN(兴飞); JLCPCB Part Class: Extended Part; link: https://so.szlcsc.com/global.html?k=C541852&ref=editor
D1 D2 = 1N5819WS: Contributor: LCSC; Supplier: LCSC; Supplier Part: C191023; Manufacturer: Hottech(合科泰); JLCPCB Part Class: Basic Part; link: https://so.szlcsc.com/global.html?k=C191023&ref=editor
FUSE1 FUSE2 = PPTC0.5A/24V 自恢复保险丝-0603: Contributor: LCSC; Supplier: LCSC; Supplier Part: C9900007586; Manufacturer: null; JLCPCB Part Class: Extended Part
L1 = CBW160808U102T: Supplier: LCSC; Manufacturer: FH; Supplier Part: C50069; JLCPCB Part Class: Extended Part
LED1 LED2 = LED0603: Supplier: LCSC; Supplier Part: C2892154; Manufacturer: GBG; Manufacturer Part: GBG-C192KRKT; link: https://atta.szlcsc.comnull; Contributor: Denjhang
LT1-LT5 = 简易音量指示灯模块: Contributor: denjhang
U5 = AMS1117-2.5: Supplier: LCSC; Manufacturer: AMS; Supplier Part: C12087; JLCPCB Part Class: Extended Part; link: https://so.szlcsc.com/global.html?k=C12087&ref=editor

## Nets
2V5: FUSE2.2 H3.5 LED2.2(A) U1.3(IN1+) U1.5(IN2+) U2.3(IN1+) U2.5(IN2+) U3.3(IN1+) U3.5(IN2+) U4.3(IN1+) U4.5(IN2+) U6.3(IN1+) U6.5(IN2+)
GND: C26.1 C27.1 H2.7 H4.1 LT1.2(GND) LT2.2(GND) LT3.2(GND) LT4.2(GND) LT5.2(GND) R3.1 R4.1 R5.1 R26.2 R27.2 RV1.1 RV2.1 RV3.1 RV4.1 U1.4(VCC-) U2.4(VCC-) U3.4(VCC-) U4.4(VCC-) U5.1(GND) U6.4(VCC-)
A.VCC: C26.2 H4.3 L1.2 LED1.2(A) LT1.4(VCC) LT2.4(VCC) LT3.4(VCC) LT4.4(VCC) LT5.4(VCC) U1.8(VCC+) U2.8(VCC+) U3.8(VCC+) U4.8(VCC+) U5.3(In) U6.8(VCC+)
A.VCC_IN: D1.2(A) H2.1
CH-A1O: C1.1 R3.2 SW3.5
CH-B1O: C2.1 R4.2 SW3.2
CH-C1O: C3.1 R5.2 SW2.5
FM-L-Mix: R14.1 SW4.3
FM-L-Mix1: SW4.2 SW6.1 SW6.6
FM-M-Mix: R17.1 R23.1 SW6.3 SW6.4
FM-R-Mix: R19.1 SW4.1
IN.FM-L: C24.1 H2.2 RV4.3
IN.FM-R: C25.1 H2.3 RV4.5
MLO-L-Mix: R16.1 SW4.6
MLO-L-Mix1: SW4.5 SW5.1 SW5.6
MLO-M-Mix: R18.1 R22.1 SW5.3 SW5.4
MLO-R-Mix: R21.1 SW4.4
MO-AMP: C10.1 H4.4
MO-Mono: C19.1 LT3.3(CH2) SW5.5
OPLL-AMP: C13.1 H4.2
OPLL-M: C18.1 LT4.3(CH2) SW6.5
OPLL-MO: H1.4 H3.1
OPLL-RO: H1.3 H3.3
OPN-FM: C12.1 H1.2
OPN-FM-Mono: C21.1 LT4.1(CH1) SW6.2
OUT.L: C33.1 H2.5 LT5.1(CH1)
OUT.R: C32.1 H2.6 LT5.3(CH2)
PSG-L: C4.1 R1.1 R1.2 R2.2 SW1.1 SW1.6
PSG-L0: SW1.5 SW3.1 SW3.6
PSG-L-Mix: C9.1 R15.1
PSG-M: R2.1 R7.1 SW1.3 SW1.4
PSG-M0: SW1.2 SW2.3 SW2.4
PSG-M1: SW2.2 SW3.3 SW3.4
PSG-R: C5.1 R6.1 R6.2 R7.2 SW2.1 SW2.6
PSG-R-Mix: C8.1 R20.1
RO-AMP: C11.1 H4.5
RO-Mono: C20.1 LT3.1(CH1) SW5.2
SSG-A: C1.2 H1.7 LT1.1(CH1)
SSG-B: C2.2 H1.6 LT1.3(CH2)
SSG-C: C3.2 H1.5 LT2.1(CH1)
Net-(C4-2): C4.2 RV1.3
Net-(C5-2): C5.2 RV1.5
Net-(C6-1): C6.1 R8.1 RV1.4 U1.6(IN2-)
Net-(C6-2): C6.2 C8.2 R8.2 U1.7(OUT2)
Net-(C7-1): C7.1 R9.1 RV1.2 U1.2(IN1-)
Net-(C7-2): C7.2 C9.2 R9.2 U1.1(OUT1)
Net-(C10-2): C10.2 RV2.3
Net-(C11-2): C11.2 RV2.5
Net-(C12-2): C12.2 RV3.3
Net-(C13-2): C13.2 RV3.5
Net-(C14-1): C14.1 R10.1 RV2.4 U2.6(IN2-)
Net-(C14-2): C14.2 C20.2 R10.2 U2.7(OUT2)
Net-(C15-1): C15.1 R11.1 RV3.4 U3.6(IN2-)
Net-(C15-2): C15.2 C18.2 R11.2 U3.7(OUT2)
Net-(C16-1): C16.1 R12.1 RV2.2 U2.2(IN1-)
Net-(C16-2): C16.2 C19.2 R12.2 U2.1(OUT1)
Net-(C17-1): C17.1 R13.1 RV3.2 U3.2(IN1-)
Net-(C17-2): C17.2 C21.2 R13.2 U3.1(OUT1)
Net-(C22-1): C22.1 R14.2 R15.2 R16.2 R17.2 R18.2 R24.1 U4.2(IN1-)
Net-(C22-2): C22.2 C24.2 R24.2 U4.1(OUT1)
Net-(C23-1): C23.1 R19.2 R20.2 R21.2 R22.2 R23.2 R25.1 U4.6(IN2-)
Net-(C23-2): C23.2 C25.2 R25.2 U4.7(OUT2)
Net-(C27-2): C27.2 D2.2(A) U5.2(Out) U5.4(TAB)
Net-(C28-1): C28.1 C31.1 R29.1 U6.2(IN1-)
Net-(C28-2): C28.2 RV4.2
Net-(C29-1): C29.1 C30.1 R28.1 U6.6(IN2-)
Net-(C29-2): C29.2 RV4.4
Net-(C30-2): C30.2 C32.2 R28.2 U6.7(OUT2)
Net-(C31-2): C31.2 C33.2 R29.2 U6.1(OUT1)
Net-(D1-1): D1.1(K) FUSE1.1
Net-(D2-1): D2.1(K) FUSE2.1
Net-(FUSE1-2): FUSE1.2 L1.1
Net-(LED1-1): LED1.1(C) R26.1
Net-(LED2-1): LED2.1(C) R27.1

Not connected (* = marked no-connect by the designer): H1 1*; H2 4*; H3 2* 4*; LT2 3(CH2)*; RV1 6(EH)* 7(EH)*; RV2 6(EH)* 7(EH)*; RV3 6(EH)* 7(EH)*; RV4 6(EH)* 7(EH)*

## Notes on the sheets
sheet 3
- L和M对调
- C-M,C-R
- A-L，B-R
- A-R，B-L
- L
- M
- R
- 000
- A
- B
- C
- 001
- B
- A
- C
- 010
- A
- C
- B
- 011
- B
- C
- A
- 100
- B
- A
- C
- 101
- A
- B
- C
- 110
- C
- A
- B
- 111
- C
- B
- A
- C
- A
- B
- PSG立体声混音电阻
sheet 4
- LR对调
- MO和RO切换L，M
- OPLL和OPN切换L，M
- 音量调节，放大
- L
- M
- R
- L
- M
- R
- 00
- MO
- RO
- X
- 00
- OPLL
- OPN
- X
- 01
- RO
- MO
- X
- 01
- OPN
- OPLL
- X
- 10
- X
- RO
- MO
- 10
- X
- OPN
- OPLL
- 11
- X
- MO
- RO
- 11
- X
- OPLL
- OPN
- 音量调节，放大
sheet 5
- 电阻并联，阻值减小
